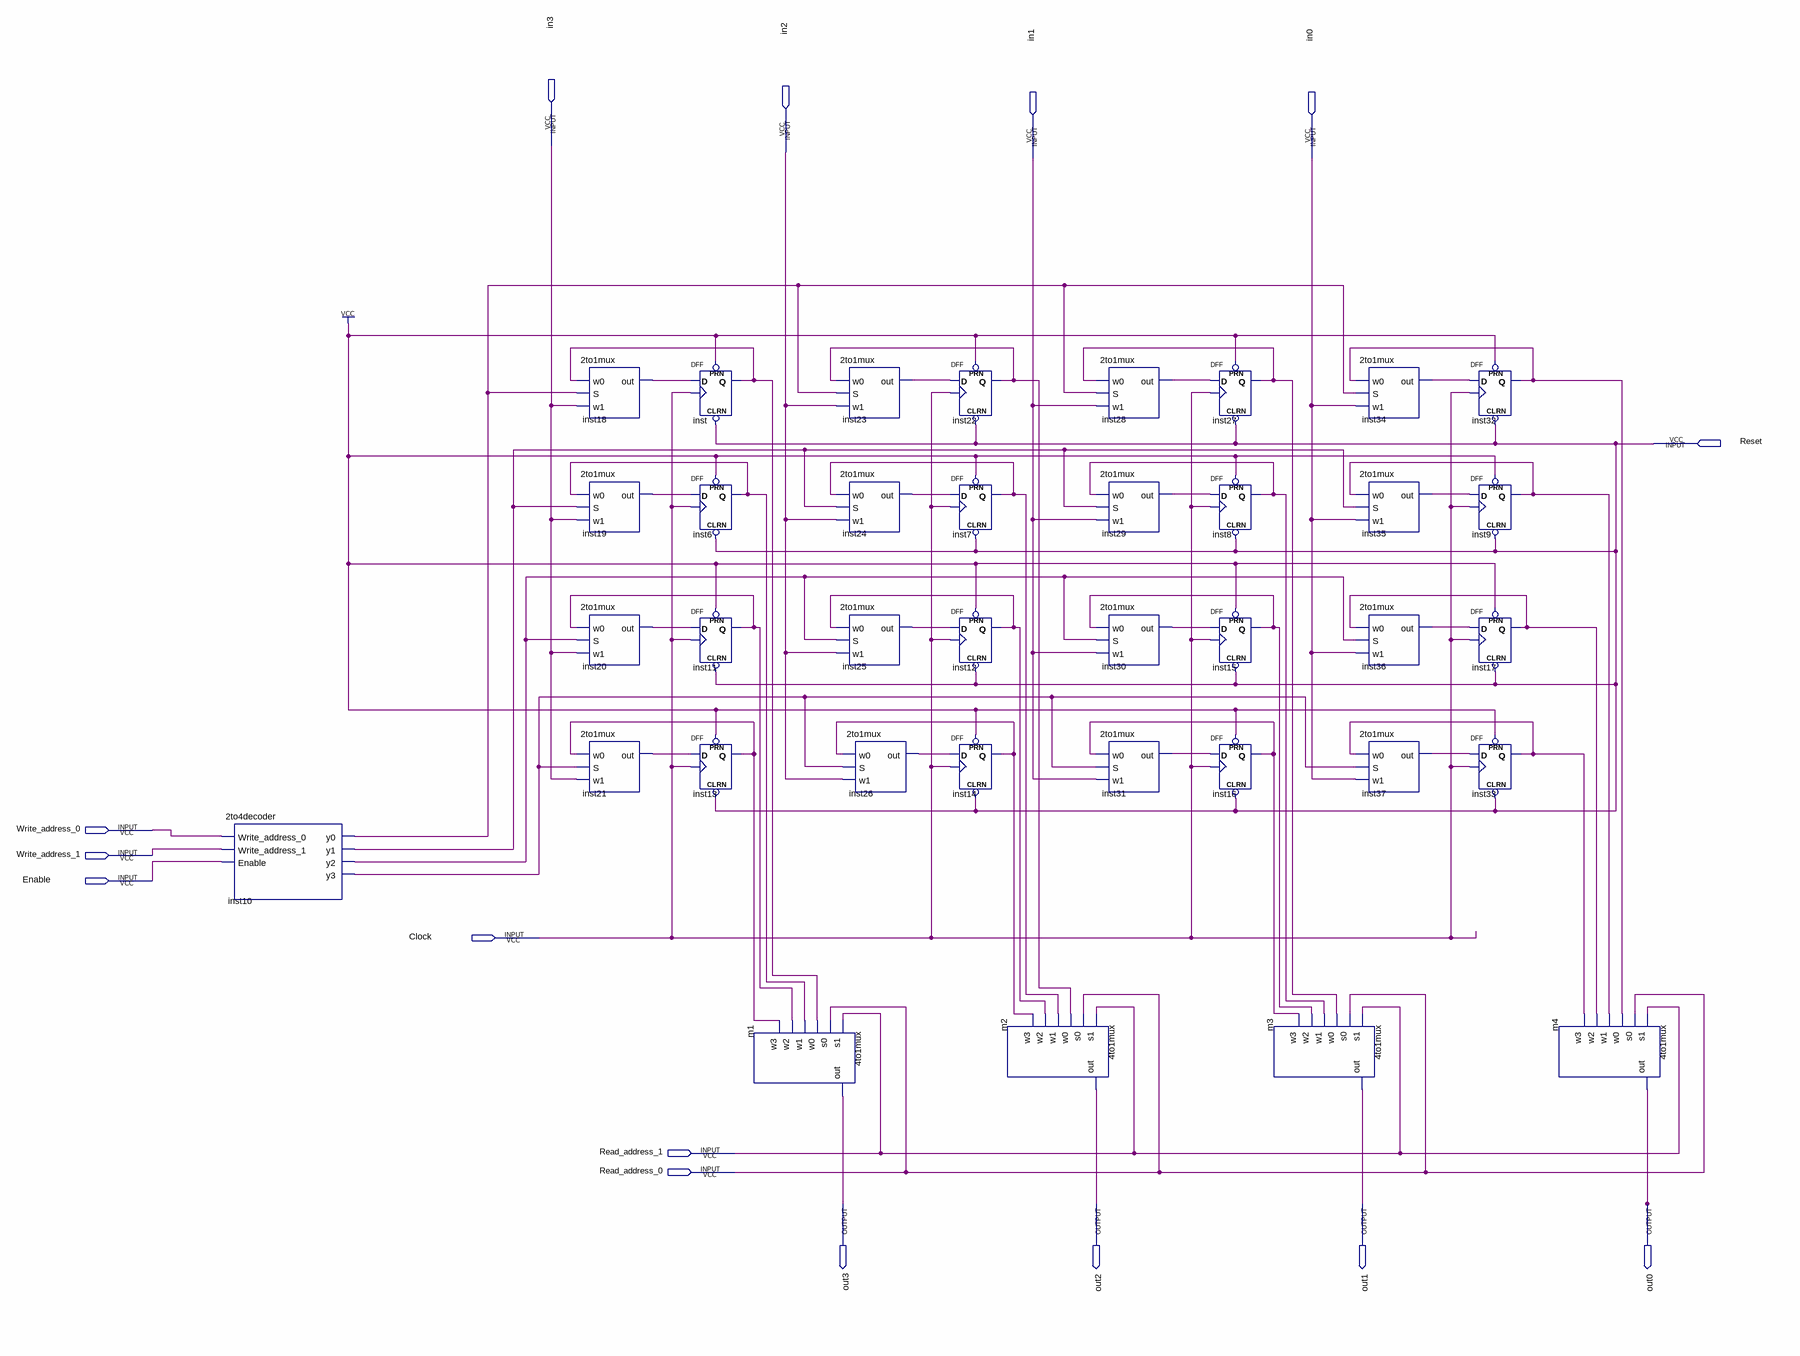
[diagram p0: schematic sheet]
// Quartus schematic 5bitregister.bdf as structural Verilog: 37 symbols, 15 pins
module \5bitregister  (
  input  in3,
  input  in2,
  input  in1,
  input  in0,
  input  Reset,
  input  Write_address_0,
  input  Write_address_1,
  input  Enable,
  input  Clock,
  input  Read_address_1,
  input  Read_address_0,
  output out3,
  output out2,
  output out1,
  output out0
);

  wire inst6_q, inst7_q, inst8_q, inst9_q, inst10_y0, inst10_y1, inst10_y2, inst10_y3, inst11_q, inst12_q,
       inst13_q, inst14_q, inst15_q, inst16_q, inst17_q, inst18_out, inst19_out, inst20_out, inst21_out,
       inst22_q, inst23_out, inst24_out, inst25_out, inst26_out, inst27_q, inst28_out, inst29_out,
       inst30_out, inst31_out, inst32_q, inst33_q, inst34_out, inst35_out, inst36_out, inst37_out, inst_q;

  \2to4decoder  inst10 (
    .Write_address_0(Write_address_0), .Write_address_1(Write_address_1), .Enable(Enable), .y0(inst10_y0),
    .y1(inst10_y1), .y2(inst10_y2), .y3(inst10_y3));
  \2to1mux  inst18 (.w0(inst_q), .S(inst10_y0), .w1(in3), .out(inst18_out));
  \2to1mux  inst19 (.w0(inst6_q), .S(inst10_y1), .w1(in3), .out(inst19_out));
  \2to1mux  inst20 (.w0(inst11_q), .S(inst10_y2), .w1(in3), .out(inst20_out));
  \2to1mux  inst21 (.w0(inst13_q), .S(inst10_y3), .w1(in3), .out(inst21_out));
  DFF inst (.CLRN(Reset), .CLK(Clock), .D(inst18_out), .PRN(1'b1), .Q(inst_q));
  DFF inst6 (.CLRN(Reset), .CLK(Clock), .D(inst19_out), .PRN(1'b1), .Q(inst6_q));
  DFF inst11 (.CLRN(Reset), .CLK(Clock), .D(inst20_out), .PRN(1'b1), .Q(inst11_q));
  DFF inst13 (.CLRN(Reset), .CLK(Clock), .D(inst21_out), .PRN(1'b1), .Q(inst13_q));
  \4to1mux  m1 (
    .s1(Read_address_1), .s0(Read_address_0), .w0(inst_q), .w1(inst6_q), .w2(inst11_q), .w3(inst13_q),
    .out(out3));
  \2to1mux  inst23 (.w0(inst22_q), .S(inst10_y0), .w1(in2), .out(inst23_out));
  \2to1mux  inst24 (.w0(inst7_q), .S(inst10_y1), .w1(in2), .out(inst24_out));
  \2to1mux  inst25 (.w0(inst12_q), .S(inst10_y2), .w1(in2), .out(inst25_out));
  \2to1mux  inst26 (.w0(inst14_q), .S(inst10_y3), .w1(in2), .out(inst26_out));
  DFF inst22 (.CLRN(Reset), .CLK(Clock), .D(inst23_out), .PRN(1'b1), .Q(inst22_q));
  DFF inst7 (.CLRN(Reset), .CLK(Clock), .D(inst24_out), .PRN(1'b1), .Q(inst7_q));
  DFF inst12 (.CLRN(Reset), .CLK(Clock), .D(inst25_out), .PRN(1'b1), .Q(inst12_q));
  DFF inst14 (.CLRN(Reset), .CLK(Clock), .D(inst26_out), .PRN(1'b1), .Q(inst14_q));
  \4to1mux  m2 (
    .s1(Read_address_1), .s0(Read_address_0), .w0(inst22_q), .w1(inst7_q), .w2(inst12_q), .w3(inst14_q),
    .out(out2));
  \2to1mux  inst28 (.w0(inst27_q), .S(inst10_y0), .w1(in1), .out(inst28_out));
  \2to1mux  inst29 (.w0(inst8_q), .S(inst10_y1), .w1(in1), .out(inst29_out));
  \2to1mux  inst30 (.w0(inst15_q), .S(inst10_y2), .w1(in1), .out(inst30_out));
  \2to1mux  inst31 (.w0(inst16_q), .S(inst10_y3), .w1(in1), .out(inst31_out));
  DFF inst27 (.CLRN(Reset), .CLK(Clock), .D(inst28_out), .PRN(1'b1), .Q(inst27_q));
  DFF inst8 (.CLRN(Reset), .CLK(Clock), .D(inst29_out), .PRN(1'b1), .Q(inst8_q));
  DFF inst15 (.CLRN(Reset), .CLK(Clock), .D(inst30_out), .PRN(1'b1), .Q(inst15_q));
  DFF inst16 (.CLRN(Reset), .CLK(Clock), .D(inst31_out), .PRN(1'b1), .Q(inst16_q));
  \4to1mux  m3 (
    .s1(Read_address_1), .s0(Read_address_0), .w0(inst27_q), .w1(inst8_q), .w2(inst15_q), .w3(inst16_q),
    .out(out1));
  \2to1mux  inst34 (.w0(inst32_q), .S(inst10_y0), .w1(in0), .out(inst34_out));
  \2to1mux  inst35 (.w0(inst9_q), .S(inst10_y1), .w1(in0), .out(inst35_out));
  \2to1mux  inst36 (.w0(inst17_q), .S(inst10_y2), .w1(in0), .out(inst36_out));
  \2to1mux  inst37 (.w0(inst33_q), .S(inst10_y3), .w1(in0), .out(inst37_out));
  DFF inst32 (.CLRN(Reset), .CLK(Clock), .D(inst34_out), .PRN(1'b1), .Q(inst32_q));
  DFF inst9 (.CLRN(Reset), .CLK(Clock), .D(inst35_out), .PRN(1'b1), .Q(inst9_q));
  DFF inst17 (.CLRN(Reset), .CLK(Clock), .D(inst36_out), .PRN(1'b1), .Q(inst17_q));
  DFF inst33 (.CLRN(Reset), .CLK(Clock), .D(inst37_out), .PRN(1'b1), .Q(inst33_q));
  \4to1mux  m4 (
    .s1(Read_address_1), .s0(Read_address_0), .w0(inst32_q), .w1(inst9_q), .w2(inst17_q), .w3(inst33_q),
    .out(out0));
endmodule
